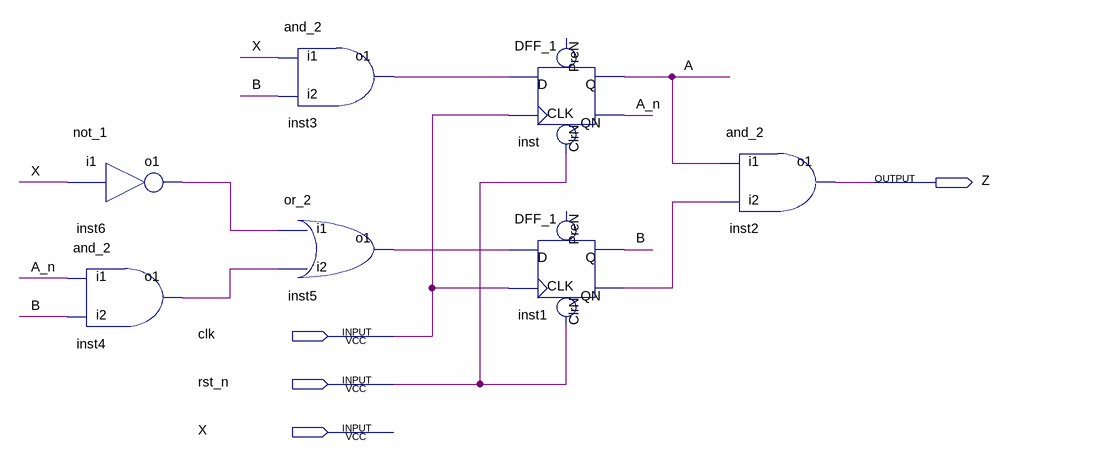
[diagram p0: schematic sheet]
// Quartus schematic SD.bdf as structural Verilog: 7 symbols, 4 pins
module SD (
  input  clk,
  input  rst_n,
  input  X,
  output Z
);

  wire A, A_n, B, inst1_qn, inst3_o1, inst4_o1, inst5_o1, inst6_o1;

  not_1 inst6 (.i1(X), .o1(inst6_o1));
  and_2 inst4 (.i1(A_n), .i2(B), .o1(inst4_o1));
  and_2 inst3 (.i1(X), .i2(B), .o1(inst3_o1));
  or_2 inst5 (.i1(inst6_o1), .i2(inst4_o1), .o1(inst5_o1));
  DFF_1 inst (.CLK(clk), .D(inst3_o1), .ClrN(rst_n), .QN(A_n), .Q(A));  // open: PreN
  DFF_1 inst1 (.CLK(clk), .D(inst5_o1), .ClrN(rst_n), .QN(inst1_qn), .Q(B));  // open: PreN
  and_2 inst2 (.i1(A), .i2(inst1_qn), .o1(Z));
endmodule
